# Altium schematic sheet HEADERS_UNOQ_MALE.SchDoc: HEADERS UNO Q MALE
size A3; Author: Silvio Navaretti; CompanyName: Arduino SRL; DrawnBy: Silvio Navaretti; Engineer: Silvio Navaretti; Organization: Arduino SRL; DocumentNumber: ASX00083; SheetNumber: 2; SheetTotal: 11; RevAuthor: Silvio Navaretti
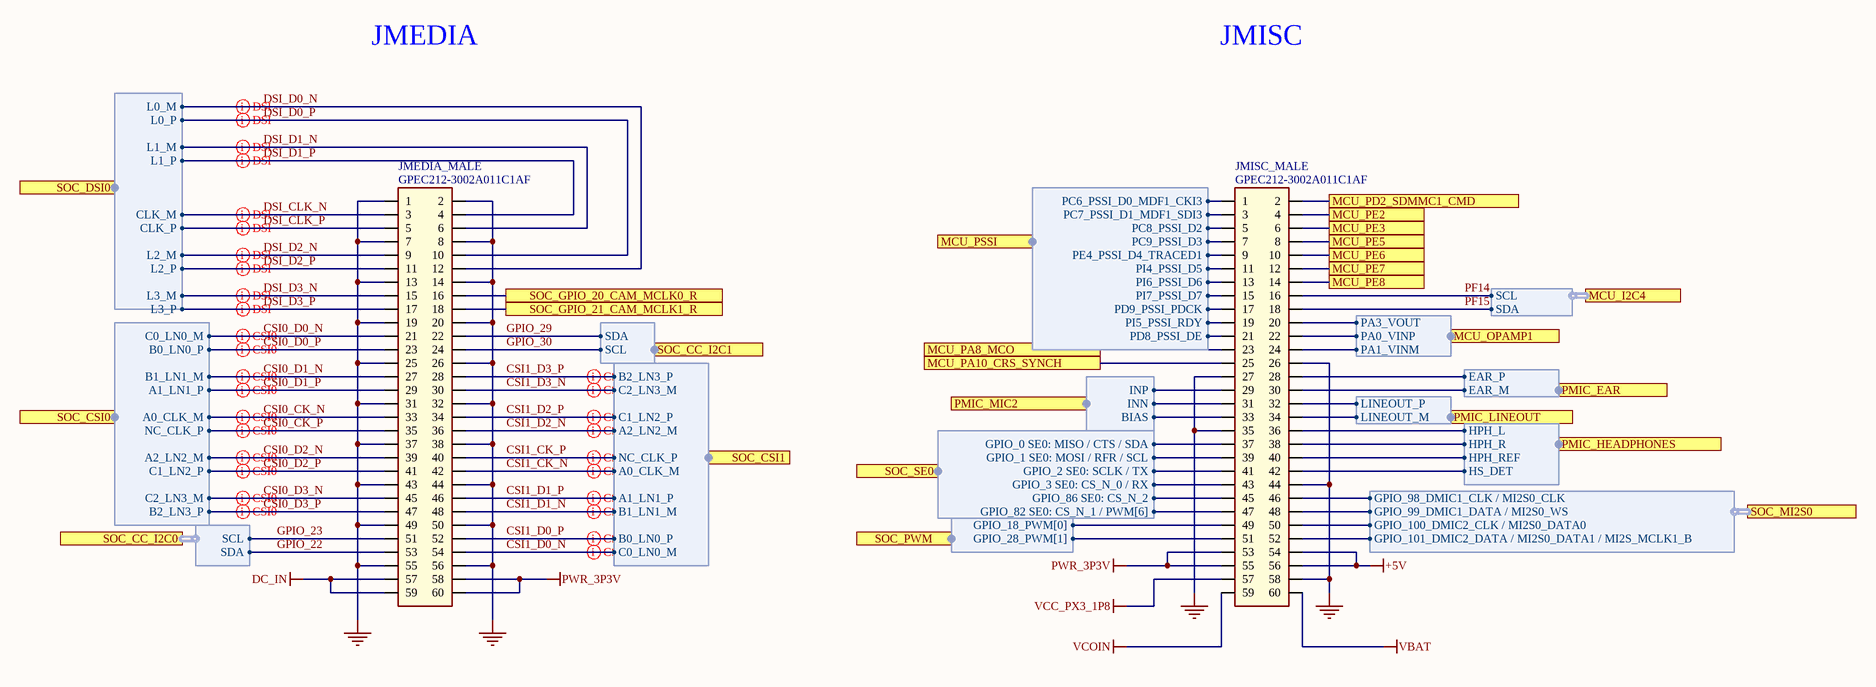
[diagram p0: HEADERS_UNOQ_MALE.SchDoc]

## Parts
JMEDIA_MALE  GPEC212-3002A011C1AF  [GPEC212-3002A011C1AF]
JMISC_MALE  GPEC212-3002A011C1AF  [GPEC212-3002A011C1AF]

## Ports
MCU_I2C4 (harness I2C), MCU_OPAMP1 (harness MCU_OPAMP), MCU_PA8_MCO, MCU_PA10_CRS_SYNCH, MCU_PD2_SDMMC1_CMD, MCU_PE2, MCU_PE3, MCU_PE5, MCU_PE6, MCU_PE7, MCU_PE8, MCU_PSSI (harness PSSI_MCU), PMIC_EAR (harness EAT), PMIC_HEADPHONES (harness HEADPHONES), PMIC_LINEOUT (harness LINEOUT), PMIC_MIC2 (harness MIC), SOC_CC_I2C0 (harness I2C), SOC_CC_I2C1 (harness I2C), SOC_CSI0 (harness IMOLA_CSI), SOC_CSI1 (harness IMOLA_CSI), SOC_DSI0 (harness IMOLA_DSI), SOC_GPIO_20_CAM_MCLK0_R, SOC_GPIO_21_CAM_MCLK1_R, SOC_MI2S0 (harness SOC_I2S), SOC_PWM (harness SOC_PWM), SOC_SE0 (harness SOC_GPIO)

## Harnesses
IMOLA_DSI: L1_P, L1_M, L3_P, L3_M, CLK_P, CLK_M, L0_P, L0_M, L2_P, L2_M
I2C: SDA, SCL
IMOLA_CSI: C2_LN3_M, A2_LN2_M, C1_LN2_P, C0_LN0_M, B0_LN0_P, A0_CLK_M, NC_CLK_P, B1_LN1_M, A1_LN1_P, B2_LN3_P
PSSI_MCU: PC6_PSSI_D0_MDF1_CKI3, PC7_PSSI_D1_MDF1_SDI3, PC8_PSSI_D2, PC9_PSSI_D3, PE4_PSSI_D4_TRACED1, PI4_PSSI_D5, PI6_PSSI_D6, PI7_PSSI_D7, PD9_PSSI_PDCK, PI5_PSSI_RDY, PD8_PSSI_DE
MCU_OPAMP: PA3_VOUT, PA0_VINP, PA1_VINM
EAT: EAR_P, EAR_M
MIC: INP, INN, BIAS
LINEOUT: LINEOUT_P, LINEOUT_M
HEADPHONES: HPH_L, HPH_R, HPH_REF, HS_DET
SOC_GPIO: GPIO_0 SE0: MISO / CTS / SDA, GPIO_1 SE0: MOSI / RFR / SCL, GPIO_2 SE0: SCLK / TX, GPIO_3 SE0: CS_N_0 / RX, GPIO_86 SE0: CS_N_2, GPIO_82 SE0: CS_N_1 / PWM[6]
SOC_I2S: GPIO_98_DMIC1_CLK / MI2S0_CLK, GPIO_99_DMIC1_DATA / MI2S0_WS, GPIO_100_DMIC2_CLK / MI2S0_DATA0, GPIO_101_DMIC2_DATA / MI2S0_DATA1 / MI2S_MCLK1_B
SOC_PWM: GPIO_18_PWM[0], GPIO_28_PWM[1]

## Nets
+5V: JMISC_MALE.54 JMISC_MALE.56
DC_IN: JMEDIA_MALE.57 JMEDIA_MALE.59
GND: JMEDIA_MALE.1 JMEDIA_MALE.2 JMEDIA_MALE.7 JMEDIA_MALE.8 JMEDIA_MALE.13 JMEDIA_MALE.14 JMEDIA_MALE.19 JMEDIA_MALE.20 JMEDIA_MALE.25 JMEDIA_MALE.26 JMEDIA_MALE.31 JMEDIA_MALE.32 JMEDIA_MALE.37 JMEDIA_MALE.38 JMEDIA_MALE.43 JMEDIA_MALE.44 JMEDIA_MALE.49 JMEDIA_MALE.50 JMEDIA_MALE.55 JMEDIA_MALE.56 JMISC_MALE.26 JMISC_MALE.27 JMISC_MALE.35 JMISC_MALE.44 JMISC_MALE.58
PWR_3P3V: JMEDIA_MALE.58 JMEDIA_MALE.60 JMISC_MALE.53 JMISC_MALE.55
VBAT: JMISC_MALE.60
VCC_PX3_1P8: JMISC_MALE.57
VCOIN: JMISC_MALE.59
CSI0_CK_N: JMEDIA_MALE.33 ; port SOC_CSI0.A0_CLK_M
CSI0_CK_P: JMEDIA_MALE.35 ; port SOC_CSI0.NC_CLK_P
CSI0_D0_N: JMEDIA_MALE.21 ; port SOC_CSI0.C0_LN0_M
CSI0_D0_P: JMEDIA_MALE.23 ; port SOC_CSI0.B0_LN0_P
CSI0_D1_N: JMEDIA_MALE.27 ; port SOC_CSI0.B1_LN1_M
CSI0_D1_P: JMEDIA_MALE.29 ; port SOC_CSI0.A1_LN1_P
CSI0_D2_N: JMEDIA_MALE.39 ; port SOC_CSI0.A2_LN2_M
CSI0_D2_P: JMEDIA_MALE.41 ; port SOC_CSI0.C1_LN2_P
CSI0_D3_N: JMEDIA_MALE.45 ; port SOC_CSI0.C2_LN3_M
CSI0_D3_P: JMEDIA_MALE.47 ; port SOC_CSI0.B2_LN3_P
CSI1_CK_N: JMEDIA_MALE.42 ; port SOC_CSI1.A0_CLK_M
CSI1_CK_P: JMEDIA_MALE.40 ; port SOC_CSI1.NC_CLK_P
CSI1_D0_N: JMEDIA_MALE.54 ; port SOC_CSI1.C0_LN0_M
CSI1_D0_P: JMEDIA_MALE.52 ; port SOC_CSI1.B0_LN0_P
CSI1_D1_N: JMEDIA_MALE.48 ; port SOC_CSI1.B1_LN1_M
CSI1_D1_P: JMEDIA_MALE.46 ; port SOC_CSI1.A1_LN1_P
CSI1_D2_N: JMEDIA_MALE.36 ; port SOC_CSI1.A2_LN2_M
CSI1_D2_P: JMEDIA_MALE.34 ; port SOC_CSI1.C1_LN2_P
CSI1_D3_N: JMEDIA_MALE.30 ; port SOC_CSI1.C2_LN3_M
CSI1_D3_P: JMEDIA_MALE.28 ; port SOC_CSI1.B2_LN3_P
DSI_CLK_N: JMEDIA_MALE.3 ; port SOC_DSI0.CLK_M
DSI_CLK_P: JMEDIA_MALE.5 ; port SOC_DSI0.CLK_P
DSI_D0_N: JMEDIA_MALE.12 ; port SOC_DSI0.L0_M
DSI_D0_P: JMEDIA_MALE.10 ; port SOC_DSI0.L0_P
DSI_D1_N: JMEDIA_MALE.6 ; port SOC_DSI0.L1_M
DSI_D1_P: JMEDIA_MALE.4 ; port SOC_DSI0.L1_P
DSI_D2_N: JMEDIA_MALE.9 ; port SOC_DSI0.L2_M
DSI_D2_P: JMEDIA_MALE.11 ; port SOC_DSI0.L2_P
DSI_D3_N: JMEDIA_MALE.15 ; port SOC_DSI0.L3_M
DSI_D3_P: JMEDIA_MALE.17 ; port SOC_DSI0.L3_P
GPIO_22: JMEDIA_MALE.53 ; port SOC_CC_I2C0.SDA
GPIO_23: JMEDIA_MALE.51 ; port SOC_CC_I2C0.SCL
GPIO_29: JMEDIA_MALE.22 ; port SOC_CC_I2C1.SDA
GPIO_30: JMEDIA_MALE.24 ; port SOC_CC_I2C1.SCL
MCU_PA8_MCO: JMISC_MALE.23 ; port MCU_PA8_MCO
MCU_PA10_CRS_SYNCH: JMISC_MALE.25 ; port MCU_PA10_CRS_SYNCH
MCU_PD2_SDMMC1_CMD: JMISC_MALE.2 ; port MCU_PD2_SDMMC1_CMD
MCU_PE2: JMISC_MALE.4 ; port MCU_PE2
MCU_PE3: JMISC_MALE.6 ; port MCU_PE3
MCU_PE5: JMISC_MALE.8 ; port MCU_PE5
MCU_PE6: JMISC_MALE.10 ; port MCU_PE6
MCU_PE7: JMISC_MALE.12 ; port MCU_PE7
MCU_PE8: JMISC_MALE.14 ; port MCU_PE8
PF14: JMISC_MALE.16 ; port MCU_I2C4.SCL
PF15: JMISC_MALE.18 ; port MCU_I2C4.SDA
SOC_GPIO_20_CAM_MCLK0_R: JMEDIA_MALE.16 ; port SOC_GPIO_20_CAM_MCLK0_R
SOC_GPIO_21_CAM_MCLK1_R: JMEDIA_MALE.18 ; port SOC_GPIO_21_CAM_MCLK1_R
NetJMISC_MALE_1: JMISC_MALE.1 ; port MCU_PSSI.PC6_PSSI_D0_MDF1_CKI3
NetJMISC_MALE_3: JMISC_MALE.3 ; port MCU_PSSI.PC7_PSSI_D1_MDF1_SDI3
NetJMISC_MALE_5: JMISC_MALE.5 ; port MCU_PSSI.PC8_PSSI_D2
NetJMISC_MALE_7: JMISC_MALE.7 ; port MCU_PSSI.PC9_PSSI_D3
NetJMISC_MALE_9: JMISC_MALE.9 ; port MCU_PSSI.PE4_PSSI_D4_TRACED1
NetJMISC_MALE_11: JMISC_MALE.11 ; port MCU_PSSI.PI4_PSSI_D5
NetJMISC_MALE_13: JMISC_MALE.13 ; port MCU_PSSI.PI6_PSSI_D6
NetJMISC_MALE_15: JMISC_MALE.15 ; port MCU_PSSI.PI7_PSSI_D7
NetJMISC_MALE_17: JMISC_MALE.17 ; port MCU_PSSI.PD9_PSSI_PDCK
NetJMISC_MALE_19: JMISC_MALE.19 ; port MCU_PSSI.PI5_PSSI_RDY
NetJMISC_MALE_20: JMISC_MALE.20 ; port MCU_OPAMP1.PA3_VOUT
NetJMISC_MALE_21: JMISC_MALE.21 ; port MCU_PSSI.PD8_PSSI_DE
NetJMISC_MALE_22: JMISC_MALE.22 ; port MCU_OPAMP1.PA0_VINP
NetJMISC_MALE_24: JMISC_MALE.24 ; port MCU_OPAMP1.PA1_VINM
NetJMISC_MALE_28: JMISC_MALE.28 ; port PMIC_EAR.EAR_P
NetJMISC_MALE_29: JMISC_MALE.29 ; port PMIC_MIC2.INP
NetJMISC_MALE_30: JMISC_MALE.30 ; port PMIC_EAR.EAR_M
NetJMISC_MALE_31: JMISC_MALE.31 ; port PMIC_MIC2.INN
NetJMISC_MALE_32: JMISC_MALE.32 ; port PMIC_LINEOUT.LINEOUT_P
NetJMISC_MALE_33: JMISC_MALE.33 ; port PMIC_MIC2.BIAS
NetJMISC_MALE_34: JMISC_MALE.34 ; port PMIC_LINEOUT.LINEOUT_M
NetJMISC_MALE_36: JMISC_MALE.36 ; port PMIC_HEADPHONES.HPH_L
NetJMISC_MALE_37: JMISC_MALE.37 ; port SOC_SE0.GPIO_0 SE0: MISO / CTS / SDA
NetJMISC_MALE_38: JMISC_MALE.38 ; port PMIC_HEADPHONES.HPH_R
NetJMISC_MALE_39: JMISC_MALE.39 ; port SOC_SE0.GPIO_1 SE0: MOSI / RFR / SCL
NetJMISC_MALE_40: JMISC_MALE.40 ; port PMIC_HEADPHONES.HPH_REF
NetJMISC_MALE_41: JMISC_MALE.41 ; port SOC_SE0.GPIO_2 SE0: SCLK / TX
NetJMISC_MALE_42: JMISC_MALE.42 ; port PMIC_HEADPHONES.HS_DET
NetJMISC_MALE_43: JMISC_MALE.43 ; port SOC_SE0.GPIO_3 SE0: CS_N_0 / RX
NetJMISC_MALE_45: JMISC_MALE.45 ; port SOC_SE0.GPIO_86 SE0: CS_N_2
NetJMISC_MALE_46: JMISC_MALE.46 ; port SOC_MI2S0.GPIO_98_DMIC1_CLK / MI2S0_CLK
NetJMISC_MALE_47: JMISC_MALE.47 ; port SOC_SE0.GPIO_82 SE0: CS_N_1 / PWM[6]
NetJMISC_MALE_48: JMISC_MALE.48 ; port SOC_MI2S0.GPIO_99_DMIC1_DATA / MI2S0_WS
NetJMISC_MALE_49: JMISC_MALE.49 ; port SOC_PWM.GPIO_18_PWM[0]
NetJMISC_MALE_50: JMISC_MALE.50 ; port SOC_MI2S0.GPIO_100_DMIC2_CLK / MI2S0_DATA0
NetJMISC_MALE_51: JMISC_MALE.51 ; port SOC_PWM.GPIO_28_PWM[1]
NetJMISC_MALE_52: JMISC_MALE.52 ; port SOC_MI2S0.GPIO_101_DMIC2_DATA / MI2S0_DATA1 / MI2S_MCLK1_B

## Layout directives
differential pair; differential pair class DSI; net class IMPEDANCE_100R: DSI_CLK_N, DSI_CLK_P, DSI_D0_N, DSI_D0_P, DSI_D1_N, DSI_D1_P, DSI_D2_N, DSI_D2_P, DSI_D3_N, DSI_D3_P
differential pair; differential pair class CSI0; net class IMPEDANCE_100R: CSI0_CK_N, CSI0_CK_P, CSI0_D0_N, CSI0_D0_P, CSI0_D1_N, CSI0_D1_P, CSI0_D2_N, CSI0_D2_P, CSI0_D3_N, CSI0_D3_P
differential pair; differential pair class CSI1; net class IMPEDANCE_100R: CSI1_CK_N, CSI1_CK_P, CSI1_D0_N, CSI1_D0_P, CSI1_D1_N, CSI1_D1_P, CSI1_D2_N, CSI1_D2_P, CSI1_D3_N, CSI1_D3_P

## Notes on the sheet
- JMEDIA
- JMISC
- Title:
- ID:
- Date:
- Time:
- Version:
- Sheet
- of
- RevAuthor:
- Reference Designs ARE PROVIDED "AS IS" AND "WITH ALL FAULTS. Arduino SA DISCLAIMS ALL OTHER WARRANTIES, EXPRESS OR IMPLIED, REGARDING PRODUCTS, INCLUDING BUT NOT LIMITED TO, ANY IMPLIED WARRANTIES OF MERCHANTABILITY OR FITNESS FOR A PARTICULAR PURPOSE.
  Arduino SA may make changes to specifications and product descriptions at any time, without notice. The Customer must not rely on the absence or characteristics of any features or instructions marked "reserved" or "undefined".
  Arduino SA reserves these for future definition and shall have no responsibility whatsoever for conflicts or incompatibilities arising from future changes to them. The product information on the Web Site or Materials is subject to change without notice.
  Do not finalize a design with this info. ARDUINO and other Arduino brands and logos and Trademarks of Arduino SA. All Arduino SA Trademarks cannot be used without owner's formal permission.
- File:
- Author:

## Library data of the parts
JMEDIA_MALE JMISC_MALE = J0568-A.3: CONN HEADER MALE VERTICAL SMD 1.27mm 2x30 POS lead heigth 3.5mm; Manufacturer: Greenconn; Code Arduino: J0568; Part Number: GPEC212-3002A011C1AF